# EasyEDA schematic SeedUP Nano Controller_2020-11-19_18-19-23.json
TITLE: SeedUP Nano; REV: 1.0; Date: 2020-11-19; Sheet: 1/1; Drawn By: Victor Halla; Company: SeedUP
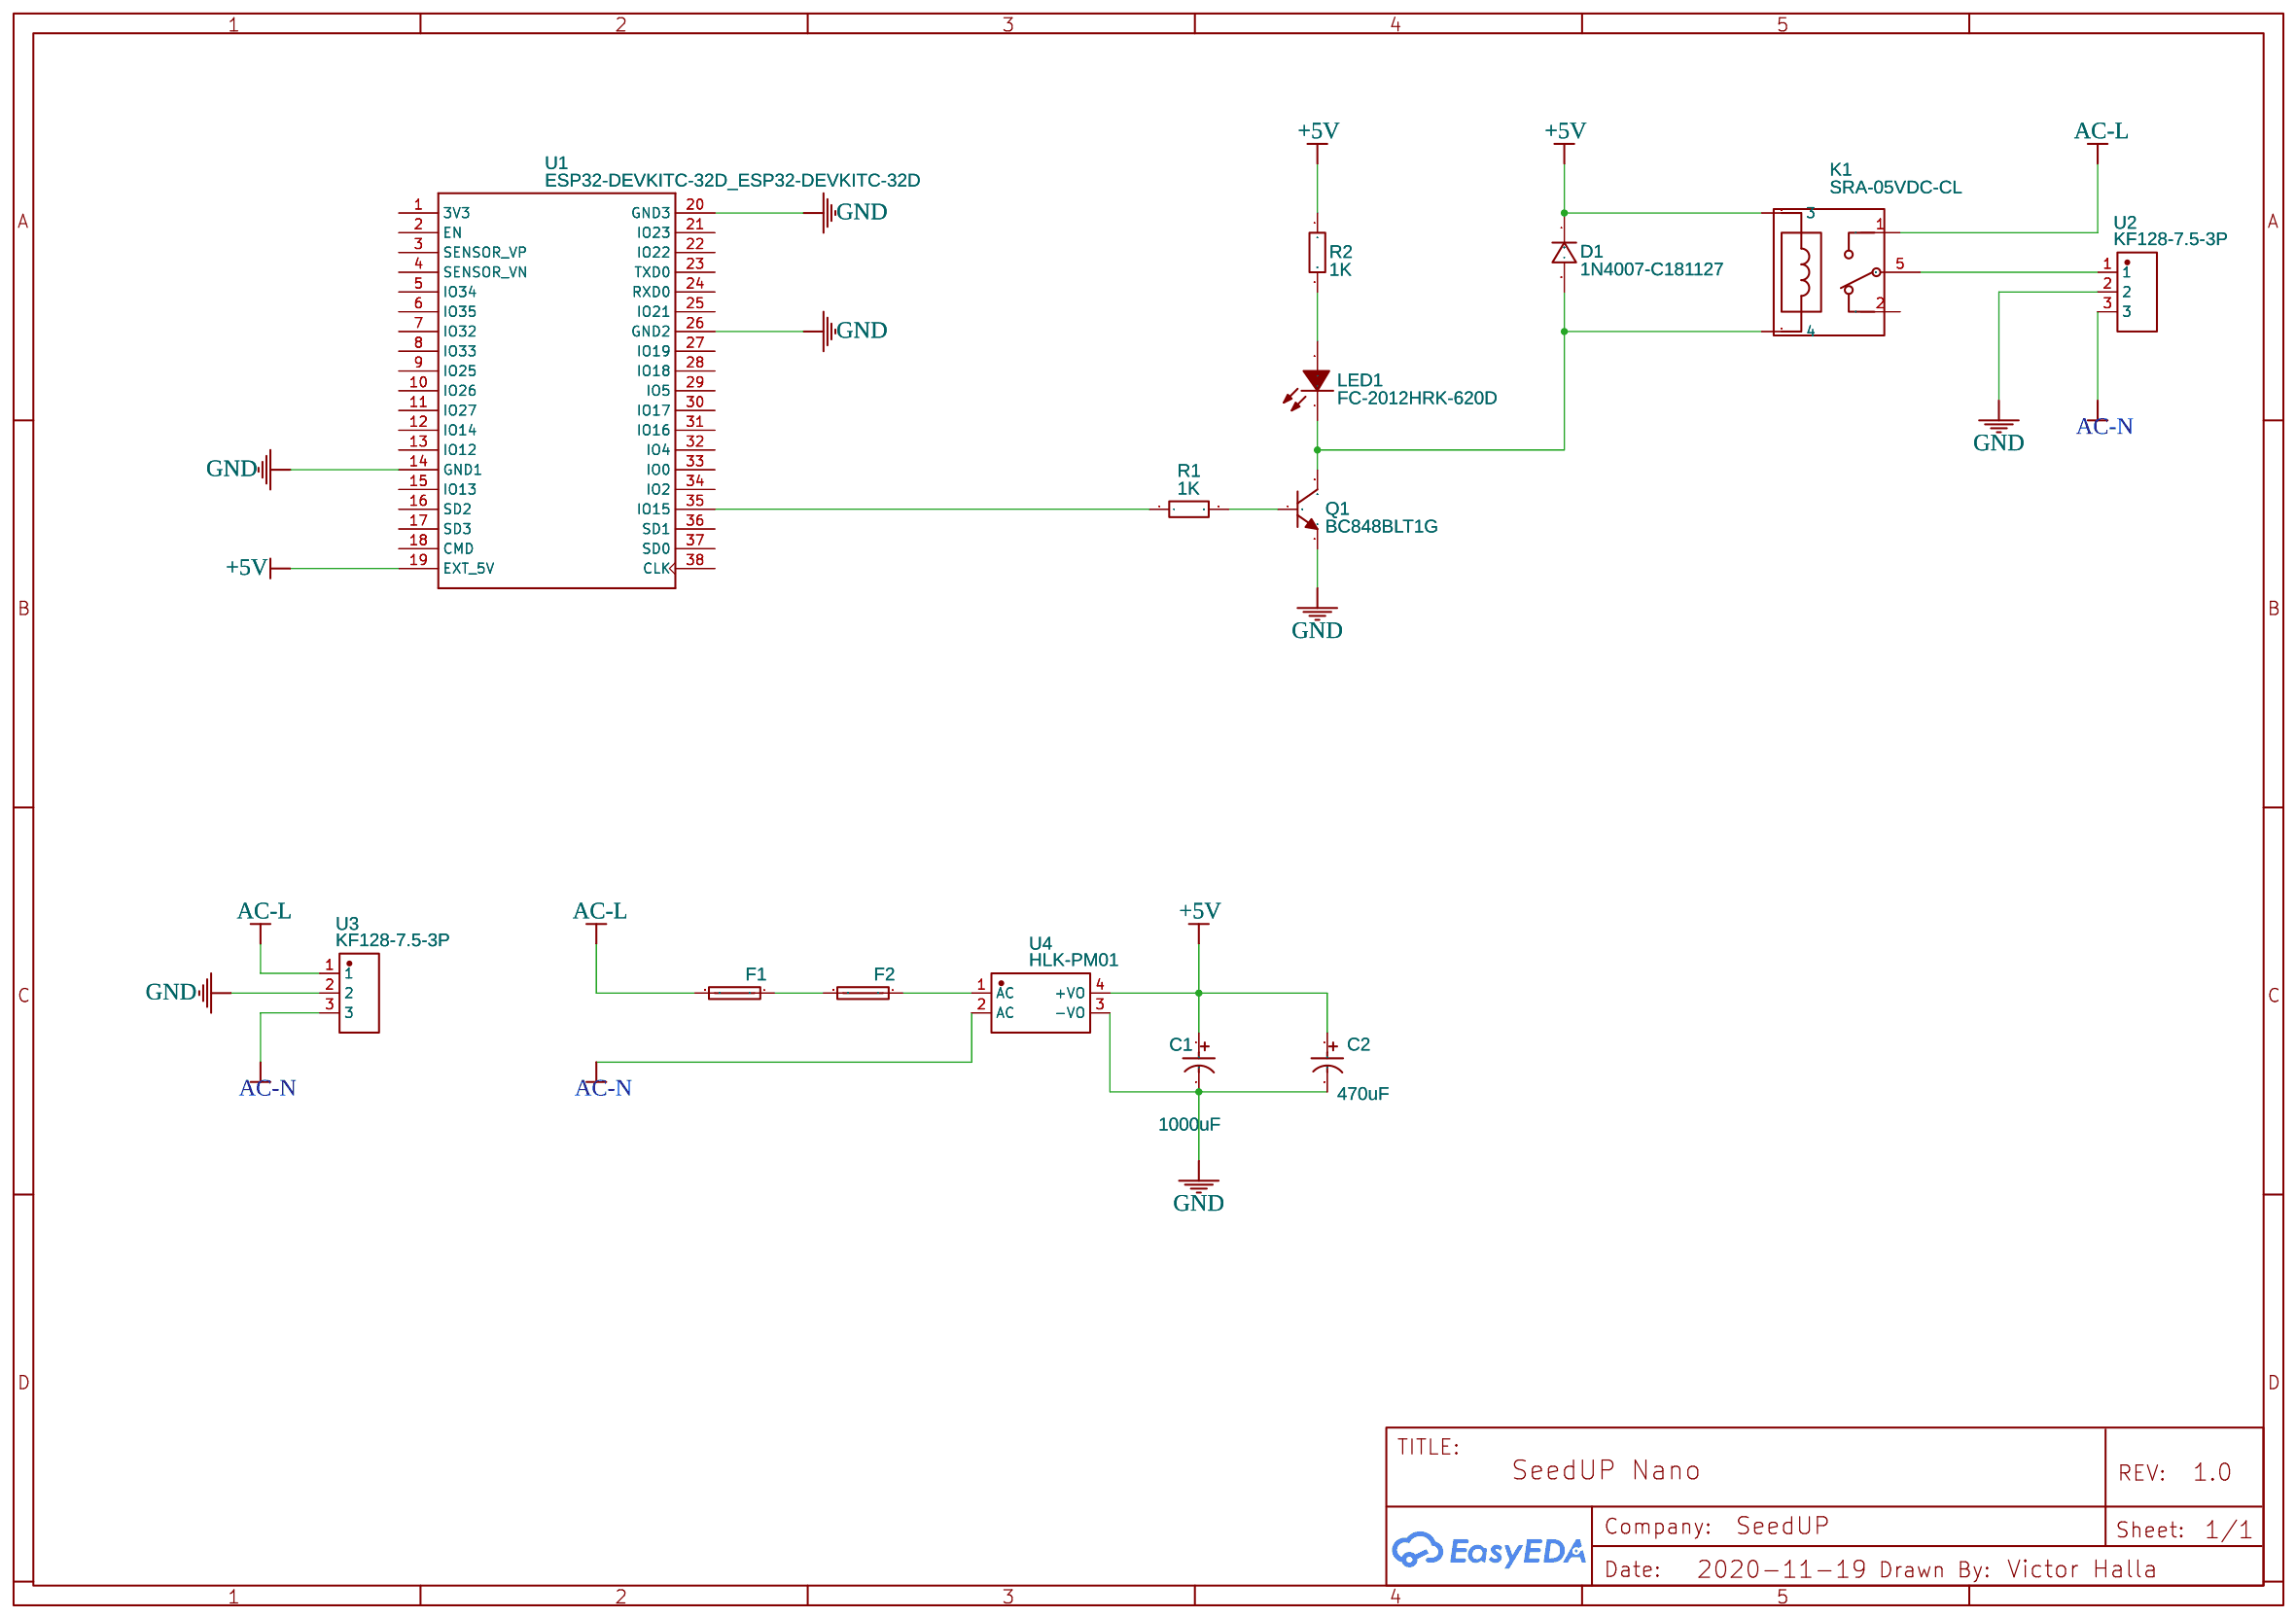
[diagram p0: schematic sheet]

## Parts
C1  1000uF  [CP_5X11MM]
C2  470uF  [CP_5X11MM]
D1  1N4007-C181127  [SOD-123F_L2.8-W1.8-LS3.7-RD]
F1  F1  [3.6X10]
F2  F2  [3.6X10]
K1  SRA-05VDC-CL  [RELAY-TH_SRA-X-CX]
LED1  FC-2012HRK-620D  [LED0805-RD]
Q1  BC848BLT1G  [SOT-23-3_L2.9-W1.6-P1.90-LS2.8-BR]
R1  1K  [R0603]
R2  1K  [R0603]
U1  ESP32-DEVKITC-32D_ESP32-DEVKITC-32D  [MODULE_ESP32-DEVKITC-32D]
U2  KF128-7.5-3P  [CONN-TH_3P-P7.50_KF128-7.5-3P]
U3  KF128-7.5-3P  [CONN-TH_3P-P7.50_KF128-7.5-3P]
U4  HLK-PM01  [PWRM-TH_HLK-PM01]

## Library data of the parts
C1 = -: Voltage: 3V; Supplier: LCSC; Manufacturer: HONOR; Manufacturer Part: RVT0J102M0810; Supplier Part: C42851
C2 = -: Voltage: 3V; Supplier: LCSC; Manufacturer: CapXon; Manufacturer Part: MV471M6R3F105R; Supplier Part: C65208
D1 = 1N4007-C181127: Supplier Part: C181127; Supplier: LCSC; Manufacturer: Hottech; Manufacturer Part: 1N4007; Contributor: LCSC; LCSC Assembly: Yes; SMT Type: Extend
F1 = -: Supplier: LCSC; Manufacturer Part: 300mA 250VAC; Manufacturer: ReliaPro; Supplier Part: C12107
F2 = -: Supplier: LCSC; Manufacturer Part: 72*C Thermal Fuse; Manufacturer: ReliaPro; Supplier Part: C12107
K1 = SRA-05VDC-CL: Supplier: LCSC; Supplier Part: C99666; Manufacturer: Ningbo Songle Relay; Contributor: LCSC
LED1 = FC-2012HRK-620D: Supplier: LCSC; Manufacturer: NATIONSTAR; image: //image.lceda.cn/szlcsc/C84256.jpg; Supplier Part: C84256; LCSC Assembly: Yes; SMT Type: Basic
Q1 = BC848BLT1G: Supplier: LCSC; Manufacturer: ON; Contributor: LCSC; Supplier Part: C163725; LCSC Assembly: Yes; SMT Type: Extend
R1 R2 = 0603WAD1001T5E: Supplier: LCSC; Manufacturer: UniOhm; Supplier Part: C51218; LCSC Assembly: Yes; SMT Type: Extend
U1 = ESP32-DEVKITC-32D_ESP32-DEVKITC-32D: Contributor: acp_
U2 U3 = KF128-7.5-3P: Supplier: LCSC; Supplier Part: C474955; Manufacturer: Cixi Kefa Elec; Contributor: LCSC
U4 = HLK-PM01: Supplier: LCSC; Supplier Part: C209903; Manufacturer: HI-LINK; Contributor: LCSC

## Nets
+5V: C1.1 C2.1 D1.1(C) K1.3 R2.1 U1.19(EXT_5V) U4.4(+VO)
GND: C1.2 C2.2 Q1.2(E) U1.14(GND1) U1.20(GND3) U1.26(GND2) U2.2 U3.2 U4.3(-VO)
AC-L: F1.2 K1.1 U3.1
AC-N: U2.3 U3.3 U4.2(AC)
Net-(D1-2): D1.2(A) K1.4 LED1.1(-) Q1.3(C)
Net-(F1-1): F1.1 F2.2
Net-(F2-1): F2.1 U4.1(AC)
Net-(K1-5): K1.5 U2.1
Net-(LED1-2): LED1.2(+) R2.2
Net-(Q1-1): Q1.1(B) R1.2
Net-(R1-1): R1.1 U1.35(IO15)

Not connected (* = marked no-connect by the designer): K1 2; U1 1(3V3) 2(EN) 3(SENSOR_VP) 4(SENSOR_VN) 5(IO34) 6(IO35) 7(IO32) 8(IO33) 9(IO25) 10(IO26) 11(IO27) 12(IO14) 13(IO12) 15(IO13) 16(SD2) 17(SD3) 18(CMD) 21(IO23) 22(IO22) 23(TXD0) 24(RXD0) 25(IO21) 27(IO19) 28(IO18) 29(IO5) 30(IO17) 31(IO16) 32(IO4) 33(IO0) 34(IO2) 36(SD1) 37(SD0) 38(CLK)
